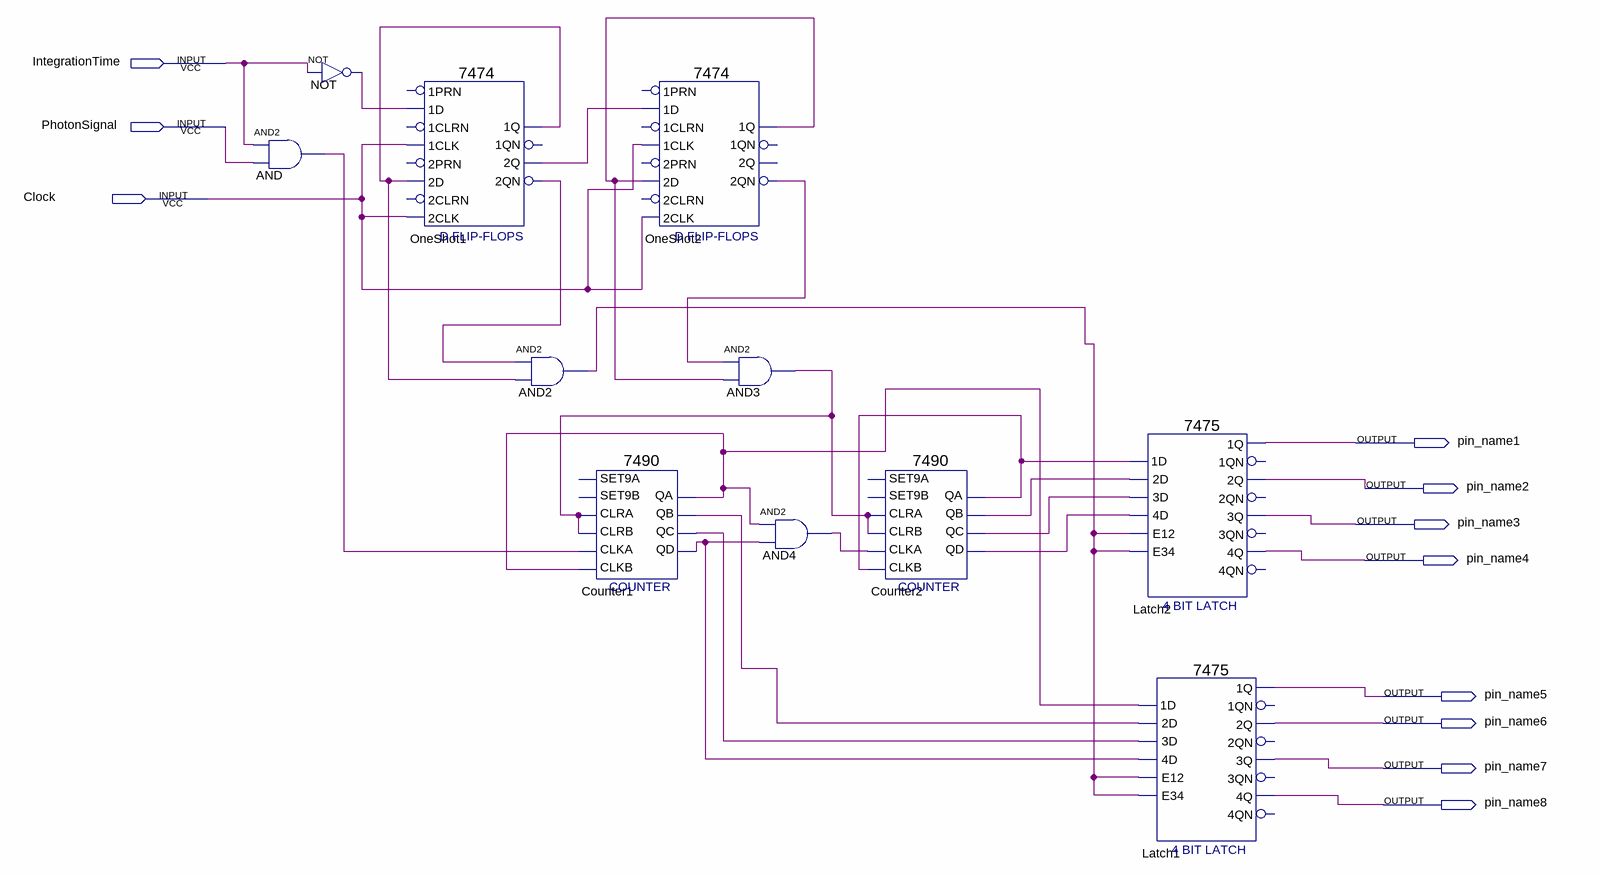
[diagram p0: schematic sheet]
// Quartus schematic PhotonCounter.bdf as structural Verilog: 11 symbols, 11 pins
module PhotonCounter (
  input  IntegrationTime,
  input  PhotonSignal,
  input  Clock,
  output pin_name1,
  output pin_name2,
  output pin_name3,
  output pin_name4,
  output pin_name5,
  output pin_name6,
  output pin_name7,
  output pin_name8
);

  wire AND2_out, AND3_out, AND4_out, AND_out, Counter1_qa, Counter1_qb, Counter1_qc, Counter1_qd,
       Counter2_qa, Counter2_qb, Counter2_qc, Counter2_qd, NOT_out, OneShot1_1q, OneShot1_2q, OneShot1_2qn,
       OneShot2_1q, OneShot2_2qn;

  and AND (AND_out, IntegrationTime, PhotonSignal);
  not NOT (NOT_out, IntegrationTime);
  \7474  OneShot1 (
    .\2D (OneShot1_1q), .\1CLK (Clock), .\1D (NOT_out), .\2CLK (Clock), .\2Q (OneShot1_2q),
    .\2QN (OneShot1_2qn), .\1Q (OneShot1_1q));  // open: 2PRN, 1PRN, 2CLRN, 1CLRN, 1QN
  and AND2 (AND2_out, OneShot1_2qn, OneShot1_1q);
  \7490  Counter1 (
    .CLRA(AND3_out), .CLKB(Counter1_qa), .CLKA(AND_out), .CLRB(AND3_out), .QD(Counter1_qd), .QA(Counter1_qa),
    .QB(Counter1_qb), .QC(Counter1_qc));  // open: SET9A, SET9B
  \7474  OneShot2 (
    .\2D (OneShot2_1q), .\1CLK (Clock), .\1D (OneShot1_2q), .\2CLK (Clock), .\2QN (OneShot2_2qn),
    .\1Q (OneShot2_1q));  // open: 2PRN, 1PRN, 2CLRN, 1CLRN, 1QN, 2Q
  and AND3 (AND3_out, OneShot2_2qn, OneShot2_1q);
  and AND4 (AND4_out, Counter1_qa, Counter1_qd);
  \7490  Counter2 (
    .CLRA(AND3_out), .CLKB(Counter2_qa), .CLKA(AND4_out), .CLRB(AND3_out), .QD(Counter2_qd),
    .QA(Counter2_qa), .QB(Counter2_qb), .QC(Counter2_qc));  // open: SET9A, SET9B
  \7475  Latch2 (
    .E12(AND2_out), .\3D (Counter2_qc), .\4D (Counter2_qd), .\2D (Counter2_qb), .E34(AND2_out),
    .\1D (Counter2_qa), .\1Q (pin_name1), .\2Q (pin_name2), .\3Q (pin_name3), .\4Q (pin_name4));  // open: 1QN, 3QN, 4QN, 2QN
  \7475  Latch1 (
    .E12(AND2_out), .\3D (Counter1_qc), .\4D (Counter1_qd), .\2D (Counter1_qb), .E34(AND2_out),
    .\1D (Counter1_qa), .\1Q (pin_name5), .\2Q (pin_name6), .\3Q (pin_name7), .\4Q (pin_name8));  // open: 1QN, 3QN, 4QN, 2QN
endmodule
